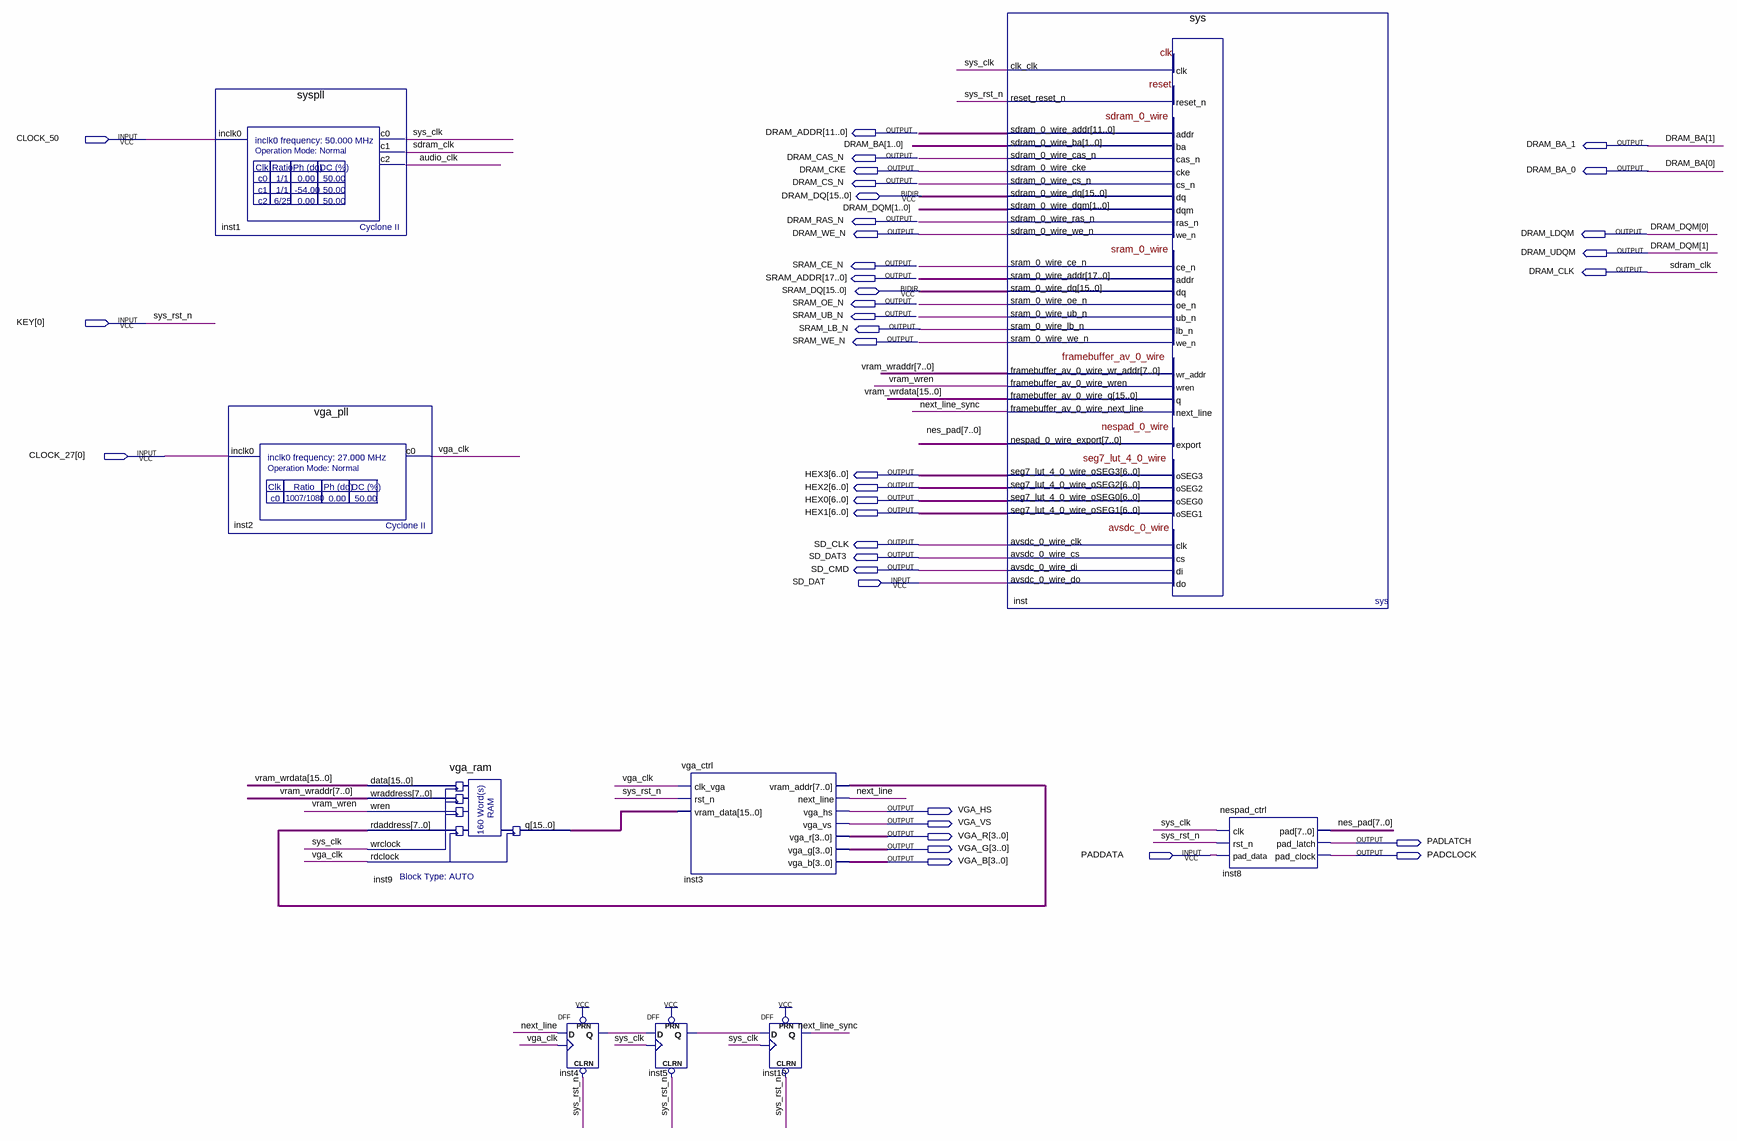
[diagram p0: schematic sheet]
// Quartus schematic gbfpga.bdf as structural Verilog: 9 symbols, 38 pins
module gbfpga (
  input  CLOCK_50,
  input  [0:0] KEY,
  input  [0:0] CLOCK_27,
  input  SD_DAT,
  input  PADDATA,
  inout  [15:0] DRAM_DQ,
  inout  [15:0] SRAM_DQ,
  output [11:0] DRAM_ADDR,
  output DRAM_BA_1,
  output DRAM_CAS_N,
  output DRAM_CKE,
  output DRAM_BA_0,
  output DRAM_CS_N,
  output DRAM_RAS_N,
  output DRAM_WE_N,
  output DRAM_LDQM,
  output DRAM_UDQM,
  output SRAM_CE_N,
  output DRAM_CLK,
  output [17:0] SRAM_ADDR,
  output SRAM_OE_N,
  output SRAM_UB_N,
  output SRAM_LB_N,
  output SRAM_WE_N,
  output [6:0] HEX3,
  output [6:0] HEX2,
  output [6:0] HEX0,
  output [6:0] HEX1,
  output SD_CLK,
  output SD_DAT3,
  output SD_CMD,
  output VGA_HS,
  output VGA_VS,
  output [3:0] VGA_R,
  output PADLATCH,
  output [3:0] VGA_G,
  output PADCLOCK,
  output [3:0] VGA_B
);

  wire audio_clk, inst4_q, inst5_q, next_line, next_line_sync, sys_clk, vga_clk, vram_wren;
  wire [7:0] inst3_vram_addr, nes_pad, vram_wraddr;
  wire [15:0] inst9_q, vram_wrdata;

  syspll inst1 (.inclk0(CLOCK_50), .c0(sys_clk), .c1(DRAM_CLK), .c2(audio_clk));
  vga_pll inst2 (.inclk0(CLOCK_27[0]), .c0(vga_clk));
  vga_ram inst9 (
    .data(vram_wrdata), .wraddress(vram_wraddr), .wren(vram_wren), .rdaddress(inst3_vram_addr),
    .wrclock(sys_clk), .rdclock(vga_clk), .q(inst9_q));
  DFF inst4 (.CLRN(KEY[0]), .CLK(vga_clk), .D(next_line), .PRN(1'b1), .Q(inst4_q));
  DFF inst5 (.CLRN(KEY[0]), .CLK(sys_clk), .D(inst4_q), .PRN(1'b1), .Q(inst5_q));
  vga_ctrl inst3 (
    .clk_vga(vga_clk), .rst_n(KEY[0]), .vram_data(inst9_q), .vram_addr(inst3_vram_addr),
    .next_line(next_line), .vga_hs(VGA_HS), .vga_vs(VGA_VS), .vga_r(VGA_R), .vga_g(VGA_G), .vga_b(VGA_B));
  DFF inst10 (.CLRN(KEY[0]), .CLK(sys_clk), .D(inst5_q), .PRN(1'b1), .Q(next_line_sync));
  sys inst (
    .clk_clk(sys_clk), .reset_reset_n(KEY[0]), .framebuffer_av_0_wire_next_line(next_line_sync),
    .nespad_0_wire_export(nes_pad), .avsdc_0_wire_do(SD_DAT), .sdram_0_wire_addr(DRAM_ADDR),
    .sdram_0_wire_ba({DRAM_BA_1, DRAM_BA_0}), .sdram_0_wire_cas_n(DRAM_CAS_N), .sdram_0_wire_cke(DRAM_CKE),
    .sdram_0_wire_cs_n(DRAM_CS_N), .sdram_0_wire_dqm({DRAM_UDQM, DRAM_LDQM}),
    .sdram_0_wire_ras_n(DRAM_RAS_N), .sdram_0_wire_we_n(DRAM_WE_N), .sram_0_wire_ce_n(SRAM_CE_N),
    .sram_0_wire_addr(SRAM_ADDR), .sram_0_wire_oe_n(SRAM_OE_N), .sram_0_wire_ub_n(SRAM_UB_N),
    .sram_0_wire_lb_n(SRAM_LB_N), .sram_0_wire_we_n(SRAM_WE_N), .framebuffer_av_0_wire_wr_addr(vram_wraddr),
    .framebuffer_av_0_wire_wren(vram_wren), .framebuffer_av_0_wire_q(vram_wrdata),
    .seg7_lut_4_0_wire_oSEG3(HEX3), .seg7_lut_4_0_wire_oSEG2(HEX2), .seg7_lut_4_0_wire_oSEG0(HEX0),
    .seg7_lut_4_0_wire_oSEG1(HEX1), .avsdc_0_wire_clk(SD_CLK), .avsdc_0_wire_cs(SD_DAT3),
    .avsdc_0_wire_di(SD_CMD), .sdram_0_wire_dq(DRAM_DQ), .sram_0_wire_dq(SRAM_DQ));
  nespad_ctrl inst8 (
    .clk(sys_clk), .rst_n(KEY[0]), .pad_data(PADDATA), .pad(nes_pad), .pad_latch(PADLATCH),
    .pad_clock(PADCLOCK));

  // Other names for the same wires on the sheet: DRAM_BA[1:0] = {DRAM_BA_1, DRAM_BA_0};
  //   DRAM_DQM[1:0] = {DRAM_UDQM, DRAM_LDQM}; sdram_clk = DRAM_CLK; sys_rst_n = KEY[0]
endmodule
